# EAGLE schematic hm-currentloop (EAGLE 9.4.2)
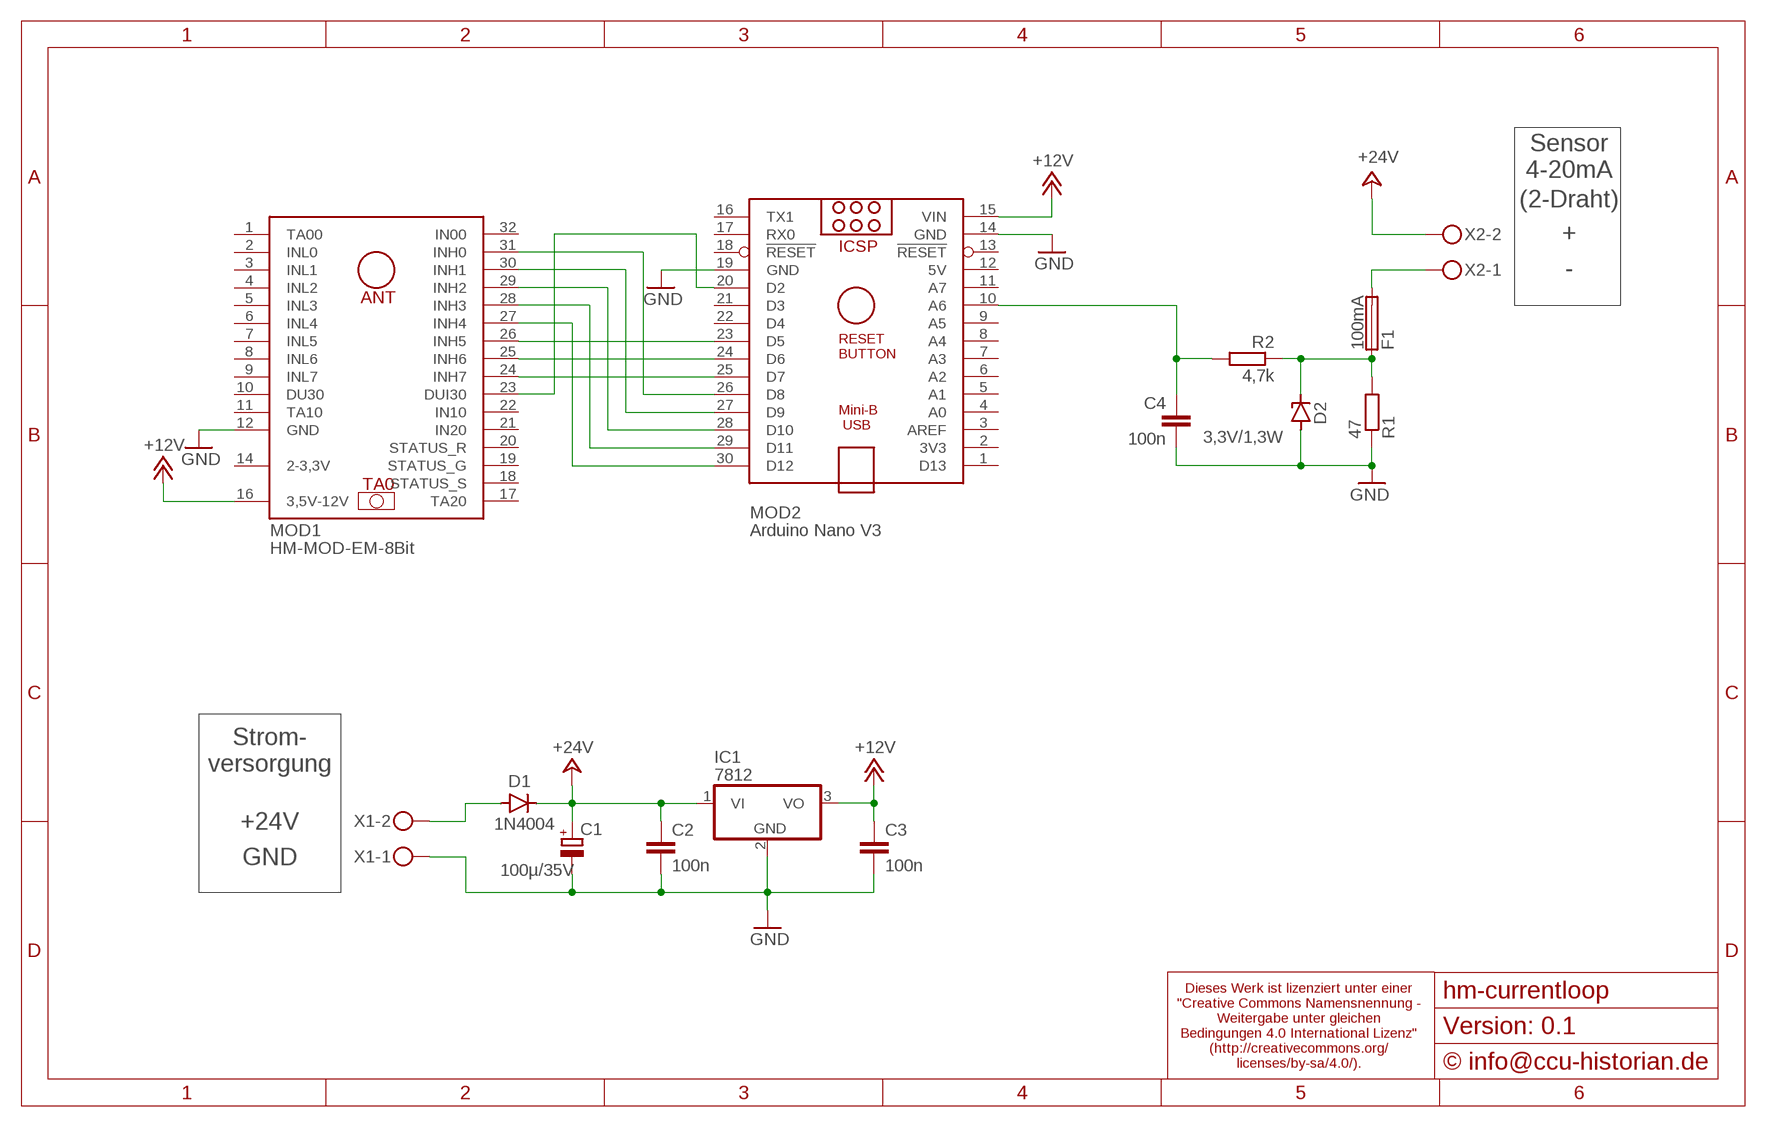
[diagram p0: schematic, sheet 1]

## Parts
C1  100µ/35V  CPOL-EUE5-6  [E5-6]
C2  100n  C-EU050-025X075  [C050-025X075]
C3  100n  C-EU050-025X075  [C050-025X075]
C4  100n  C-EU050-025X075  [C050-025X075]
D1  1N4004  [DO41-10]
D2  3,3V/1,3W  ZENER-DIODEF126-10  [F126Z10]
F1  100mA  PICOFUSE  [PICOFUSE]
IC1  7812  7812TV  [TO220V]
MOD1  HM-MOD-EM-8Bit  HM-MOD-EM-8BIT  [HM-MOD]
MOD2  Arduino Nano V3  ARDUINO_NANO  [ARDUINO_NANO]
R1  47  R-EU_0207/10  [0207/10]
R2  4,7k  R-EU_0207/10  [0207/10]
X1  MKDSN1,5/2-5,08  [MKDSN1,5/2-5,08]
X2  MKDSN1,5/2-5,08  [MKDSN1,5/2-5,08]

## Nets
+12V: C3.1 IC1.3(VO) MOD1.16(3,5V-12V) MOD2.15(VIN)
+24V: C1.+ C2.1 D1.C IC1.1(VI) X2.2
GND: C1.- C2.2 C3.2 C4.2 D2.A IC1.2(GND) MOD1.12(GND) MOD2.14(GND) MOD2.19(GND) R1.1 X1.1
N$1: D1.A X1.2
N$2: D2.C F1.1 R1.2 R2.1
N$3: F1.2 X2.1
N$4: C4.1 MOD2.10(A6) R2.2
N$5: MOD1.31(INH0) MOD2.26(D8)
N$6: MOD1.30(INH1) MOD2.27(D9)
N$7: MOD1.29(INH2) MOD2.28(D10)
N$8: MOD1.28(INH3) MOD2.29(D11)
N$9: MOD1.27(INH4) MOD2.30(D12)
N$10: MOD1.26(INH5) MOD2.23(D5)
N$11: MOD1.25(INH6) MOD2.24(D6)
N$12: MOD1.24(INH7) MOD2.25(D7)
N$13: MOD1.23(DUI30) MOD2.20(D2)
Unconnected: MOD1.1(TA00) MOD1.2(INL0) MOD1.3(INL1) MOD1.4(INL2) MOD1.5(INL3) MOD1.6(INL4) MOD1.7(INL5) MOD1.8(INL6) MOD1.9(INL7) MOD1.10(DU30) MOD1.11(TA10) MOD1.17(TA20) MOD1.18(STATUS_S) MOD1.19(STATUS_G) MOD1.20(STATUS_R) MOD1.21(IN20) MOD1.22(IN10) MOD1.32(IN00) MOD2.1(D13) MOD2.2(3V3) MOD2.3(AREF) MOD2.4(A0) MOD2.5(A1) MOD2.6(A2) MOD2.7(A3) MOD2.8(A4) MOD2.9(A5) MOD2.11(A7) MOD2.13(!RESET) MOD2.16(TX1) MOD2.17(RX0) MOD2.18(!RESET) MOD2.21(D3) MOD2.22(D4)

## Notes on the sheet
- Sensor
  4-20mA
- (2-Draht)
- +
- -
- Strom-
  versorgung
- +24V
- GND
- Dieses Werk ist lizenziert unter einer
  "Creative Commons Namensnennung -
  Weitergabe unter gleichen
  Bedingungen 4.0 International Lizenz"
  (http://creativecommons.org/
  licenses/by-sa/4.0/).
- Version: 0.1
- © info@ccu-historian.de

## Power pins joined to a net without a drawn wire
2-3,3V: MOD1.14(2-3,3V)
5V: MOD2.12(5V)

## Library data of the parts
C1 = rcl:CPOL-EU: POLARIZED CAPACITOR, European symbol; SPICEPREFIX: C
C2-C4 = rcl:C-EU: CAPACITOR, European symbol; SPICEPREFIX: C
D1 = diode:1N4004: DIODE general purpose rectifier, 1 A
D2 = diode:ZENER-DIODE: Z-Diode
F1 = fuse:PICOFUSE: PICOFUSE 19275, Wickmann; OC_FARNELL: unknown; OC_NEWARK: unknown
IC1 = linear:78*: Positive VOLTAGE REGULATOR Source: http://cache.national.com/ds/LM/LM78L05.pdf http://www.fairchildsemi.com/ds/LM/LM7805.pdf
MOD1 = homematic:HM-MOD-EM-8BIT: HM-MOD-EM-8Bit Technische Daten: Spannungsversorgung 3,5V-12V oder 2-3,3V Stromaufnahme max. 28mA (Senden) Ruhestromverbrauch max. 30µA (2-3,3V) / 60µA (3,5-12V) Anzahl der Kanäle 2 x Taster (Kanal 1 und 2), 1 x Daten (Kanal 3)
MOD2 = ArduinoNanoV30:ARDUINO_NANO: Arduino Nano V3.0 Overview: The Arduino Nano is a small, complete, and breadboard-friendly board based on the ATmega328 (Arduino Nano 3.x) or ATmega168 (Arduino Nano 2.x). It has more or less the same functionality of the Arduino Duemilanove, but in a different package. It lacks only a DC power jack, and works with a Mini-B USB cable instead of a standard one. The Nano was designed and is being produced by Gravitech. Specifications: Microcontroller Atmel ATmega168 or ATmega328 Operating Voltage (logic level) 5 V Input Voltage (recommended) 7-12 V Input Voltage (limits) 6-20 V Digital I/O Pins 14 (of which 6 provide PWM output) Analog Input Pins 8 DC Current per I/O Pin 40 mA Flash Memory 16 KB (ATmega168) or 32 KB (ATmega328) of which 2 KB used by bootloader SRAM 1 KB (ATmega168) or 2 KB (ATmega328) EEPROM 512 bytes (ATmega168) or 1 KB (ATmega328) Clock Speed 16 MHz Dimensions 0.73" x 1.70" Length 45 mm Width 18 mm Weigth 5 g Power: The Arduino Nano can be powered via the Mini-B USB connection, 6-20V unregulated external power supply (pin 30), or 5V regulated external power supply (pin 27). The power source is automatically selected to the highest voltage source. Memory: The ATmega168 has 16 KB of flash memory for storing code (of which 2 KB is used for the bootloader); the ATmega328 has 32 KB, (also with 2 KB used for the bootloader). The ATmega168 has 1 KB of SRAM and 512 bytes of EEPROM (which can be read and written with the EEPROM library); the ATmega328 has 2 KB of SRAM and 1 KB of EEPROM. Input and Output: Each of the 14 digital pins on the Nano can be used as an input or output, using pinMode(), digitalWrite(), and digitalRead() functions. They operate at 5 volts. Each pin can provide or receive a maximum of 40 mA and has an internal pull-up resistor (disconnected by default) of 20-50 kOhms. In addition, some pins have specialized functions. Visit Arduino - ArduinoBoardNano <https://www.arduino.cc/en/Main/ArduinoBoardNano>
R1 R2 = rcl:R-EU_: RESISTOR, European symbol; SPICEPREFIX: R
X1 X2 = con-phoenix-508:MKDSN1,5/2-5,08: MKDSN 1,5/ 2-5,08 Printklemme Nennstrom: 13,5 A Nennspannung: 250 V Rastermaß: 5,08 mm Polzahl: 2 Anschlussart: Schraubanschluss Montage: Löten Anschlussrichtung Leiter/Platine: 0 ° Artikelnummer: 1729128 Source: http://eshop.phoenixcontact.com .. 1729128.pdf